# Altium schematic sheet ADCAN_[sch2].SchDoc: ADCAN
size A4; SheetNumber: 2; SheetTotal: 2; University: UPC EEBE; City&Country: Barcelona Spain; Country: NSW; CP: 08019; DesignerName: Marta Basquens; Address: Av. Eduard Maristany, 16
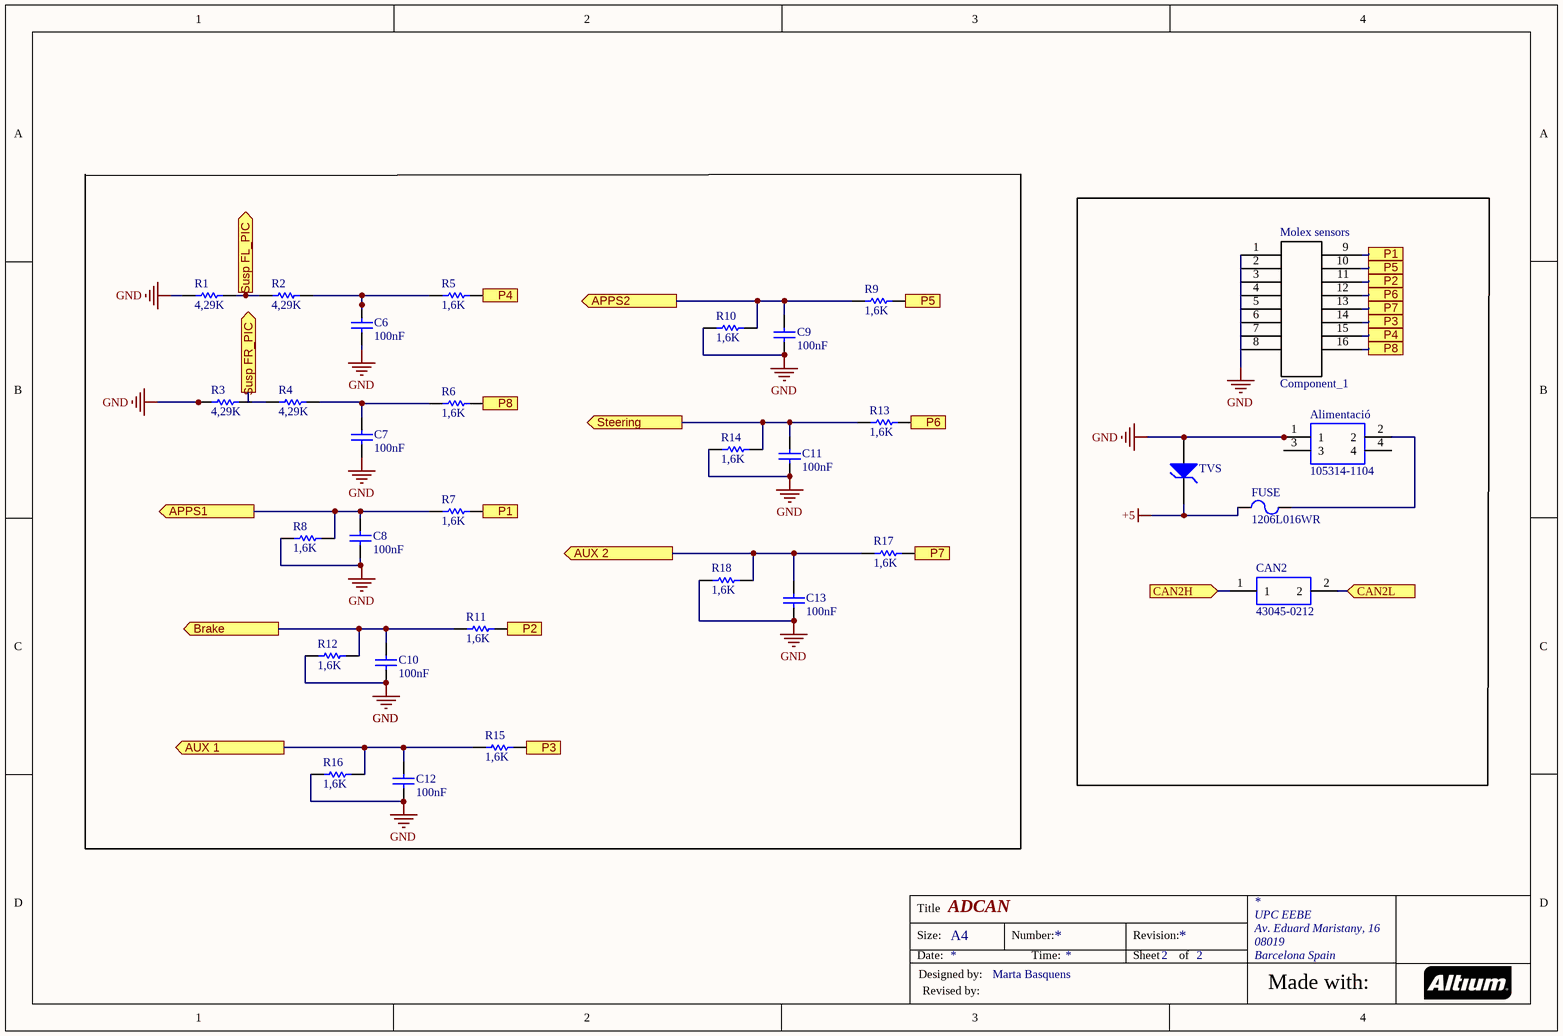
[diagram p0: ADCAN_[sch2].SchDoc]

## Parts
Alimentació  105314-1104  [1053141304]
C6  100nF  [CAPC3216X102X94LL20]
C7  100nF  [CAPC3216X102X94LL20]
C8  100nF  [CAPC3216X102X94LL20]
C9  100nF  [CAPC3216X102X94LL20]
C10  100nF  [CAPC3216X102X94LL20]
C11  100nF  [CAPC3216X102X94LL20]
C12  100nF  [CAPC3216X102X94LL20]
C13  100nF  [CAPC3216X102X94LL20]
CAN2  43045-0212  [0430450212]
FUSE  1206L016WR  [LFUS-1206L016WR_V]
Molex_sensors  Component_1  [PCBComponent_1]
R1  4,29K  [RESC1206(3216)_L]
R2  4,29K  [RESC1206(3216)_L]
R3  4,29K  [RESC1206(3216)_L]
R4  4,29K  [RESC1206(3216)_L]
R5  1,6K  [RESC1206(3216)_L]
R6  1,6K  [RESC1206(3216)_L]
R7  1,6K  [RESC1206(3216)_L]
R8  1,6K  [RESC1206(3216)_L]
R9  1,6K  [RESC1206(3216)_L]
R10  1,6K  [RESC1206(3216)_L]
R11  1,6K  [RESC1206(3216)_L]
R12  1,6K  [RESC1206(3216)_L]
R13  1,6K  [RESC1206(3216)_L]
R14  1,6K  [RESC1206(3216)_L]
R15  1,6K  [RESC1206(3216)_L]
R16  1,6K  [RESC1206(3216)_L]
R17  1,6K  [RESC1206(3216)_L]
R18  1,6K  [RESC1206(3216)_L]
TVS  (no value)  [ONSC-SMB-2-403A-03_J_V]

## Ports
APPS1 (out), APPS2 (out), AUX 1 (out), AUX 2 (out), Brake (out), CAN2H (in), CAN2L (in), P1, P2, P3, P4, P5, P6, P7, P8, Steering (out), Susp FL_PIC (out), Susp FR_PIC (out)

## Nets
+5: FUSE.1 TVS.C
GND: Alimentació.1 C6.1 C7.1 C8.1 C9.1 C10.1 C11.1 C12.1 C13.1 R1.1 R3.1 R8.2 R10.2 R12.2 R14.2 R16.2 R18.2 TVS.A
APPS1: C8.2 R7.2 R8.1 ; port APPS1
APPS2: C9.2 R9.2 R10.1 ; port APPS2
AUX 1: C12.2 R15.2 R16.1 ; port AUX 1
AUX 2: C13.2 R17.2 R18.1 ; port AUX 2
Brake: C10.2 R11.2 R12.1 ; port Brake
CAN2H: CAN2.1 ; port CAN2H
CAN2L: CAN2.2 ; port CAN2L
P1: R7.1 ; port P1
P2: R11.1 ; port P2
P3: R15.1 ; port P3
P4: R5.1 ; port P4
P5: R9.1 ; port P5
P6: R13.1 ; port P6
P7: R17.1 ; port P7
P8: R6.1 ; port P8
Steering: C11.2 R13.2 R14.1 ; port Steering
Susp FL_PIC: R1.2 R2.1 ; port Susp FL_PIC
NetAlimentació_2: Alimentació.2 FUSE.2
NetC6_2: C6.2 R2.2 R5.2
NetC7_2: C7.2 R4.2 R6.2
NetR3_1: R3.1 R4.2

Not connected (* = marked no-connect by the designer): Alimentació 3 4; Molex_sensors 1 2 3 4 5 6 7 8 9 10 11 12 13 14 15 16

## Notes on the sheet
- Title
- Size:
- Date:
- Designed by:
- A4
- Number:
- Time:
- Revision:
- Sheet
- of
- Made with:
- Revised by:

## Library data of the parts
Alimentació = 105314-1104: Molex Nano-Fit 105314, 2.5mm Pitch, 4 Way, 2 Row, Right Angle PCB Header, Through Hole; Geometry.Height: 9.14mm; Manufacturer_Name: Molex; Manufacturer_Part_Number: 105314-1104; RS Part Number: 1623690; RS Price/Stock: http://uk.rs-online.com/web/p/products/1623690; Arrow Part Number: 105314-1104; Arrow Price/Stock: http://uk.rs-online.com/web/p/products/1623690; Datasheet Link: https://www.molex.com/pdm_docs/sd/1053141104_sd.pdf
C6-C13 = CMP-2000-07385-1: Chip Capacitor, 1.05 nF, +/- 12%, 14 V, -55 to 125 degC, 1206 (3216 Metric), RoHS, Tape and Reel; Manufacturer: AVX; Brand/Series: TransGuard®; Current, Reverse, Maximum: 15 / µA; Type: TVS; Standards: ULListed; Capacitance: 1050 / pF; Energy Rating: 0.4 / Joules; Voltage, Working: 14/10 / VDC/VAC; Suppressor Type: Voltage; For Use With: IndustrialEquipment; Temperature, Junction, Maximum: +125 / °C; Configuration: Bidirectional; Current, Ratings: 150 / A; Voltage, Operating: 10/14 / VAC/VDC; Primary Type: Diodes; Voltage, Breakdown: 18.5 / V; Clamping Voltage: 32 / V; Temperature, Junction, Minimum: –55 / °C; Termination: Leadwires; Mounting Type: Thru-Hole; Current, Leakage: 15 / µA; Package Type: 1206; Current, Leakage, Maximum: 15 / µA; Manufacturer URL: http://www.avx.com/; Dimensions: 3.2Lx1.6Wx0.94T / mm; Package Reference: 1206; Datasheet URL: http://datasheets.avx.com/tguard.pdf; Current, Surge: 150 / A; Mounting Technology: SurfaceMount; Voltage, Clamping: 32 / V; Datasheet Version: 08/2016; Package Description: 2-Pin Surface Mount Device, Body 3.2 x 1.6 mm
CAN2 = 43045-0212: 2 way 2 row vertical header,3mm pitch Molex MICRO-FIT 3.0 Series, Series Number 43045, 3mm Pitch 2 Way 2 Row Shrouded Straight PCB Header, Through Hole; Allied_Number: 70090950; Manufacturer_Name: Molex; Manufacturer_Part_Number: 43045-0212; RS Part Number: 2332860P; RS Price/Stock: http://uk.rs-online.com/web/p/products/2332860P; Allied Price/Stock: https://www.alliedelec.com/molex-incorporated-43045-0212/70090950/; Arrow Part Number: 43045-0212; Arrow Price/Stock: http://uk.rs-online.com/web/p/products/2332860P; Datasheet Link: http://www.mouser.com/ds/2/276/0430450212_PCB_HEADERS-142866.pdf
FUSE = CMP-2000-05471-1: Resettable Fuse, 30 V, 100 A, 4.5 Ohm, -40 to 85 degC, 1206 (3216 Metric), RoHS, Tape and Reel; Manufacturer: Littelfuse; Hold Current [Ih]: 0.16A; Trip Current: 0.37A; Working Voltage-Max: 30V; Datasheet Version: 08/2016; Size: 1206; Manufacturer URL: http://www.littelfuse.com/; Datasheet URL: http://www.littelfuse.com/~/media/electronics/datasheets/resettable_ptcs/littelfuse_ptc_1206l_datasheet.pdf.pdf; Mounting Technology: SurfaceMount; Package Reference: 1206L016WR; Package Description: 2-Pin Surface Mount Device, Body 3.2 x 1.65 mm, Height 1.45 mm (Max); Operating Temp Range: -40to+85°C
R1-R18 = CMP-1014-00659-1: 22K 0.25W 1% 1206 (3216 Metric)  SMD; Value: 22000.00 Ohm; Case-EIA: 1206; Case-Metric: 3216; Technology: SMT; Tolerance: 1 %; Power: 0.25 W
TVS = CMP-1679-00003-1: TVS ZENER UNIDIR 600W 27V SMB; PartNumber: P6SMB27AT3G; PackageReference: SMB-2-403A-03_J; ComponentLink1URL: http://www.onsemi.com/pub_link/Collateral/P6SMB6.8AT3-D.PDF; ComponentLink1Description: Datasheet